# EAGLE design olive-scanner (EAGLE 7.5.0)
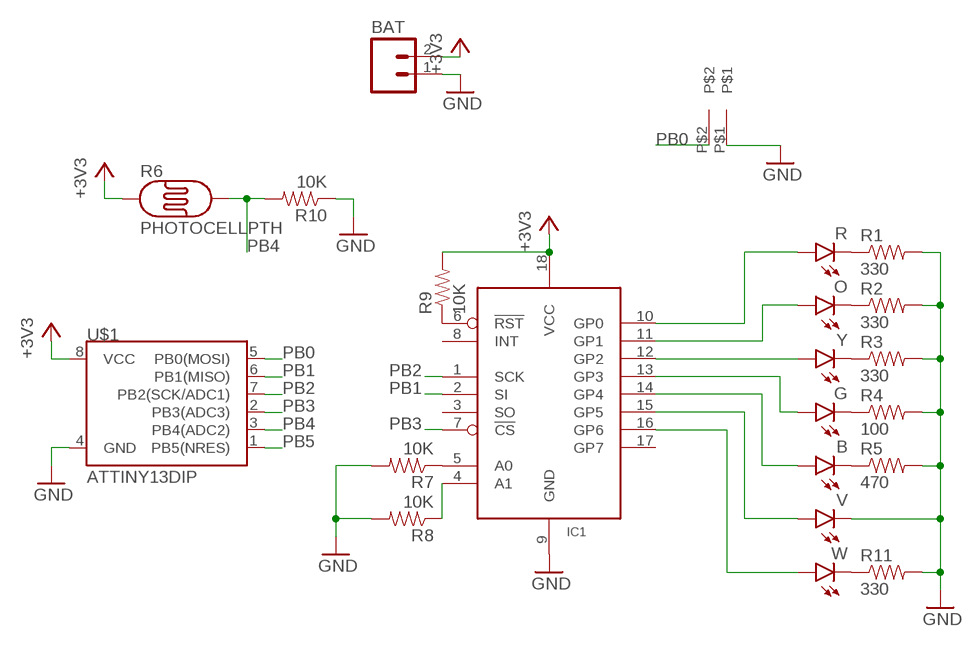
[diagram p0: schematic, sheet 1]

## Parts
B  LED5MM  [LED5MM]
BAT  M02LOCK  [1X02_LOCK]
G  LED5MM  [LED5MM]
IC1  MCP23S08/P  [DIL18]
O  LED5MM  [LED5MM]
R  LED5MM  [LED5MM]
R1  330  1KOHM-1/4W-5%(PTH)  [AXIAL-0.3]
R2  330  1KOHM-1/4W-5%(PTH)  [AXIAL-0.3]
R3  330  1KOHM-1/4W-5%(PTH)  [AXIAL-0.3]
R4  100  1KOHM-1/4W-5%(PTH)  [AXIAL-0.3]
R5  470  1KOHM-1/4W-5%(PTH)  [AXIAL-0.3]
R6  PHOTOCELLPTH  [PHOTOCELL]
R7  10K  1KOHM-1/4W-5%(PTH)  [AXIAL-0.3]
R8  10K  1KOHM-1/4W-5%(PTH)  [AXIAL-0.3]
R9  10K  1KOHM-1/4W-5%(PTH)  [AXIAL-0.3]
R10  10K  1KOHM-1/4W-5%(PTH)  [AXIAL-0.3]
R11  330  1KOHM-1/4W-5%(PTH)  [AXIAL-0.3]
U$1  ATTINY13DIP  [DIP08]
U$2  PHONE_VIBRATOR  [PHONE_VIBRATOR]
V  LED5MM  [LED5MM]
W  LED5MM  [LED5MM]
Y  LED5MM  [LED5MM]

## Nets
+3V3: BAT.2 IC1.18(VCC) R6.1 R9.P$2 U$1.8(VCC)
GND: BAT.1 IC1.9(GND) R1.P$2 R2.P$2 R3.P$2 R4.P$2 R5.P$2 R7.P$2 R8.P$2 R10.P$1 R11.P$2 U$1.4(GND) U$2.P$1 V.K(C)
N$1: IC1.4(A1) R8.P$1
N$2: IC1.6(!RST) R9.P$1
N$3: IC1.5(A0) R7.P$1
N$4: R1.P$1 R.K(C)
N$5: O.K(C) R2.P$1
N$6: R3.P$1 Y.K(C)
N$7: G.K(C) R4.P$1
N$8: B.K(C) R5.P$1
N$9: R11.P$1 W.K(C)
N$10: IC1.16(GP6) W.A
N$19: IC1.10(GP0) R.A
N$20: IC1.11(GP1) O.A
N$21: IC1.12(GP2) Y.A
N$22: G.A IC1.13(GP3)
N$23: B.A IC1.14(GP4)
N$24: IC1.15(GP5) V.A
PB0: U$1.5(PB0(MOSI)) U$2.P$2
PB1: IC1.2(SI) U$1.6(PB1(MISO))
PB2: IC1.1(SCK) U$1.7(PB2(SCK/ADC1))
PB3: IC1.7(!CS) U$1.2(PB3(ADC3))
PB4: R6.2 R10.P$2 U$1.3(PB4(ADC2))
PB5: U$1.1(PB5(NRES))
Unconnected: IC1.3(SO) IC1.8(INT) IC1.17(GP7)

## Library data of the parts
B G O R V W Y = SparkFun-LED:LED: LEDs Standard schematic elements and footprints for 5mm, 3mm, 1206, and 0603 sized LEDs. 5mm - Spark Fun Electronics SKU : COM-00529 (and others)
BAT = SparkFun-Connectors:M02: Standard 2-pin 0.1" header. Use with - straight break away headers ( PRT-00116) - right angle break away headers (PRT-00553) - swiss pins (PRT-00743) - machine pins (PRT-00117) - female headers (PRT-00115) Molex polarized connector foot print use with: PRT-08233 with associated crimp pins and housings. 2.54_SCREWTERM for use with PRT-10571. 3.5mm Screw Terminal footprints for PRT-08084 5mm Screw Terminal footprints for use with PRT-08432
IC1 = HokieGeek:MCP23S08: MCP23008 Inexpensive i2c i/o expander - 8 general purpose i/o pins with optional pullups
R1-R5 R7-R11 = SparkFun-Resistors:1KOHM-1/4W-5%(PTH): RES-08380; PROD_ID: RES-08380; VALE: 1k
R6 = SparkFun-Sensors:PHOTOCELL: CdS photoresistor. This is a low cost way to detect light levels. Resistance decreases with more incoming light. SparkFun SKU: SEN-09088
U$1 = SparkFun-DigitalIC:ATTINY13: Atmel 8-pin 1kB flash uC
U$2 = HokieGeek:PHONE_VIBRATOR

## Board
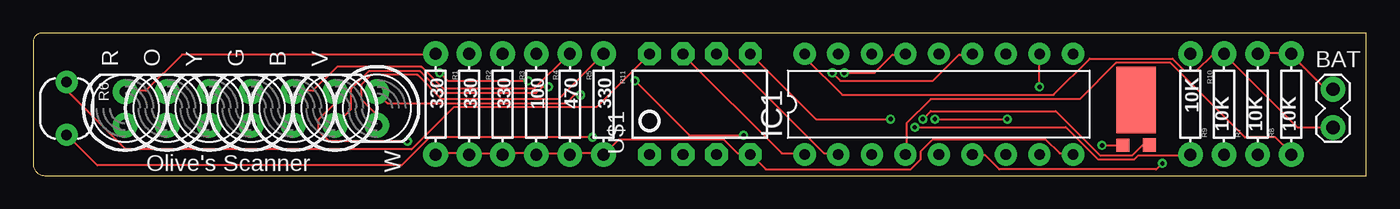
[diagram p1: board, top side]
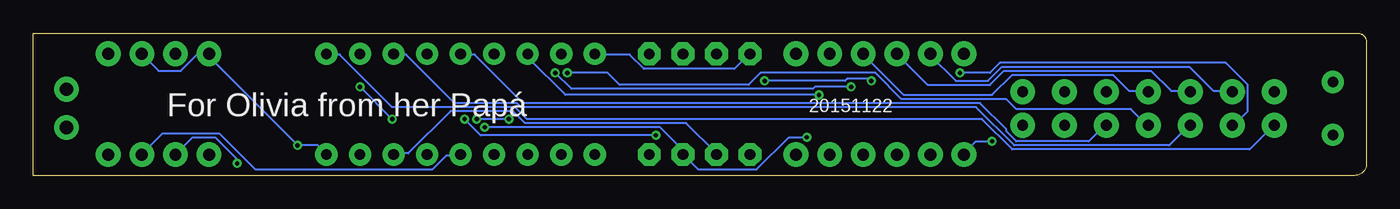
[diagram p2: board, bottom side, seen from below]

Size 100.95 x 10.79 mm. Coordinates in mm from the lower left corner, seen from the top.
Outline: 0,10.08 0,0.9 arc90 0.9,0 100.95,0 100.95,10.79 0.7,10.79 arc90 0,10.08
Copper layers (1*16): Top 0.0356mm / dielectric 1.5011mm / Bottom 0.0356mm
Design rules "LaenPCBOrder": minimum track width 6mil, minimum drill 13mil, track to track 6mil, track to pad 6mil, pad to pad 6mil, via to via 6mil, smd to smd 6mil, copper to edge 15mil, drill to drill 6mil, minimum pad ring 7mil, minimum via ring 7mil, stop-mask expansion 3mil, vias tented up to drill 0mil, thermal gap 10mil

### Footprints (pad centres in the part's own frame; a part is rotated, then mirrored left to right if it is on the bottom)
LED5MM = drill 0.813 pad 1.88: A -1.27,0; K 1.27,0
1X02_LOCK = drill 1.016 pad 1.88: 1 -0.178,0; 2 2.718,0
DIL18 = drill 0.813 pad 1.676: 1 -10.16,-3.81; 2 -7.62,-3.81; 3 -5.08,-3.81; 4 -2.54,-3.81; 5 0,-3.81; 6 2.54,-3.81; 7 5.08,-3.81; 8 7.62,-3.81; 9 10.16,-3.81; 10 10.16,3.81; 11 7.62,3.81; 12 5.08,3.81; 13 2.54,3.81; 14 0,3.81; 15 -2.54,3.81; 16 -5.08,3.81; 17 -7.62,3.81; 18 -10.16,3.81
AXIAL-0.3 = drill 0.9 pad 1.88: P$1 -3.81,0; P$2 3.81,0
PHOTOCELL = drill 0.8 pad 1.676: 1 -2,0; 2 2,0
DIP08 = drill 0.813 pad 1.727 octagon: 1 -3.81,-3.81; 2 -1.27,-3.81; 3 1.27,-3.81; 4 3.81,-3.81; 5 3.81,3.81; 6 1.27,3.81; 7 -1.27,3.81; 8 -3.81,3.81
PHONE_VIBRATOR = smd 1 x 1: P$1 -0.997,-0.889; P$2 1.005,-0.857 | smd 3 x 5: P$3 0,2.54

### Placement (x,y rotation side)
B  19.68,5.08 90 top
BAT  98.42,6.35 270 top
G  16.51,5.08 90 top
IC1  68.58,5.4 0 top
O  10.16,5.08 90 top
R  6.99,5.08 90 top
R1  30.48,5.4 270 top
R2  33.02,5.4 270 top
R3  35.56,5.4 270 top
R4  38.1,5.4 270 top
R5  40.64,5.4 270 top
R6  2.54,5.08 270 top
R7  92.71,5.4 90 top
R8  95.25,5.4 90 top
R9  90.17,5.4 90 top
R10  87.63,5.4 270 top
R11  43.18,5.4 270 top
U$1  50.48,5.4 0 top
U$2  83.5,3.17 0 top
V  22.86,5.08 90 top
W  26.04,5.08 270 top
Y  13.34,5.08 90 top

### Tracks (layer width: path | path; a pad name or v marks a point on that pad's centre or on a via)
+3V3
  Top 0.152: BAT.2 98.3,3.66 95.71,3.66 90.22,9.14 R9.P$2 90.07,9.14 89.31,9.14 88.09,7.92 87.17,7.92 86.26,8.84 80.01,8.84 77.27,6.1 61.27,6.1 58.52,8.84 58.52,9.14 IC1.18 | R6.1 2.59,7.01 2.59,6.4 7.01,1.98 28.65,1.98 31.85,5.18 42.67,5.18 46.63,9.14 U$1.8
  Bottom 0.152: IC1.18 58.37,9.14 55.78,9.14 54.71,8.08 47.85,8.08 46.79,9.14 U$1.8
GND  (via drill 0.33)
  Top 0.152: v80.92,2.29 U$2.P$1 | R7.P$2 92.81,9.3 95.25,9.3 R8.P$2 95.25,9.14 97.84,6.55 98.3,6.55 BAT.1 | 38.1,1.68 35.66,1.68 R3.P$2 35.51,1.68 33.07,1.68 R2.P$2 32.92,1.68 30.48,1.68 R1.P$2 | V.K 22.86,5.49 21.64,4.27 21.64,3.35 22.4,2.59 v28.35,2.59 | 38.1,1.68 40.54,1.68 R5.P$2 40.69,1.68 43.13,1.68 R11.P$2 43.28,1.68 44.35,2.74 52.27,2.74 53.34,1.68 54.25,1.68 U$1.4 54.41,1.52 55.47,0.46 66.45,0.46 67.21,1.22 67.21,1.83 68.12,2.74 76.66,2.74 77.72,1.68 78.64,1.68 IC1.9 | 38.1,1.68 R4.P$2
  Bottom 0.152: IC1.9 78.79,1.68 79.4,2.29 v80.92,2.29 87.78,9.14 | 87.78,9.14 88.54,9.14 89.76,7.92 91.44,7.92 92.66,9.14 R7.P$2 | 87.78,9.14 87.63,9.14 R10.P$1 87.78,9.14 | v28.35,2.59 29.57,2.59 30.48,1.68 R1.P$2
N$1
  Top 0.152: IC1.4 66.14,1.68 66.14,3.96 67.97,5.79 79.25,5.79 81.99,8.53 86.11,8.53 91.75,2.9 94.03,2.9 95.25,1.68 R8.P$1
N$2  (via drill 0.33)
  Top 0.152: v85.5,0.91 85.04,0.46 73.15,0.46 72.08,1.52 71.17,1.52 IC1.6
  Bottom 0.152: v85.5,0.91 85.5,1.22 87.17,2.9 88.85,2.9 90.07,1.68 R9.P$1
N$3
  Bottom 0.152: IC1.5 68.58,1.52 69.65,1.52 70.71,0.46 84.12,0.46 86.87,3.2 91.14,3.2 92.66,1.68 R7.P$1
N$4
  Top 0.152: R.K 7.01,6.4 8.53,6.4 11.28,9.14 30.48,9.14 R1.P$1
N$5
  Bottom 0.152: O.K 10.21,6.4 11.58,6.4 13.41,8.23 27.58,8.23 28.65,7.16 31.09,7.16 33.07,9.14 R2.P$1
N$6
  Bottom 0.152: Y.K 13.41,6.4 14.78,6.4 16.31,7.92 27.43,7.92 28.5,6.86 33.22,6.86 35.51,9.14 R3.P$1
N$7
  Bottom 0.152: G.K 16.61,6.4 17.98,6.4 19.2,7.62 26.82,7.62 28.35,6.1 35.05,6.1 38.1,9.14 R4.P$1
N$8
  Top 0.152: B.K 19.81,6.4 21.18,6.4 23.01,8.23 29.41,8.23 31.09,6.55 37.95,6.55 40.54,9.14 R5.P$1
N$9
  Top 0.152: W.K 25.91,3.81 25.91,4.72 24.84,5.79 24.84,6.86 25.6,7.62 29.11,7.62 30.94,5.79 39.78,5.79 43.13,9.14 R11.P$1
N$10  (via drill 0.33)
  Top 0.152: v41.45,6.1 41,6.1 40.39,5.49 26.82,5.49 26.06,6.25 W.A
  Bottom 0.152: v41.45,6.1 60.66,6.1 63.4,8.84 63.4,9.14 IC1.16
N$19
  Bottom 0.152: IC1.10 78.64,9.14 77.72,9.14 73.76,5.18 64.47,5.18 63.55,4.27 29.11,4.27 26.82,1.98 8.84,1.98 7.01,3.81 R.A
N$20  (via drill 0.33)
  Top 0.152: v76.2,6.71 IC1.11 | v68.28,4.27 v73.76,4.27 | v53.8,3.05 49.68,3.05 v45.57,7.16 | v37.49,7.16 31.39,7.16 v30.79,7.77
  Bottom 0.152: v73.76,4.27 v76.2,6.71 | v68.28,4.27 67.06,3.05 v53.8,3.05 | v45.57,7.16 39.47,7.16 39.32,7.32 37.64,7.32 v37.49,7.16 | v30.79,7.77 28.5,7.77 27.74,8.53 10.67,8.53 8.99,6.86 8.99,4.88 10.06,3.81 O.A
N$21
  Bottom 0.152: IC1.12 73.61,9.14 72.69,9.14 69.04,5.49 64.31,5.49 64.01,5.18 29.57,5.18 26.67,2.29 14.94,2.29 13.41,3.81 Y.A
N$22  (via drill 0.33)
  Top 0.152: v60.5,7.77 61.11,7.16 68.12,7.16 70.1,9.14 71.02,9.14 IC1.13
  Bottom 0.152: v60.5,7.77 57.45,7.77 56.54,6.86 46.79,6.86 45.87,7.77 37.19,7.77 35.2,5.79 27.28,5.79 26.52,5.03 17.83,5.03 16.61,3.81 G.A
N$23
  Bottom 0.152: IC1.14 68.58,9.14 67.51,9.14 63.86,5.49 29.26,5.49 27.28,3.5 27.28,3.35 26.52,2.59 21.03,2.59 19.81,3.81 B.A
N$24  (via drill 0.33)
  Top 0.152: v61.42,7.77 63.7,7.77 65.08,9.14 65.99,9.14 IC1.15 | v39.01,6.71 38.56,6.71 38.1,6.25 30.94,6.25 29.26,7.92 25.45,7.92 24.08,6.55 24.08,5.03 V.A
  Bottom 0.152: v61.42,7.77 60.2,6.55 41.91,6.55 41.76,6.71 v39.01,6.71
PB0  (via drill 0.33)
  Top 0.152: v67.36,4.27 67.97,4.88 77.42,4.88 80.77,1.52 83.21,1.52 83.97,2.29 84.43,2.29 U$2.P$2 | v64.92,4.27 59.28,4.27 54.41,9.14 U$1.5
  Bottom 0.152: v64.92,4.27 v67.36,4.27
PB1
  Top 0.152: IC1.2 60.96,1.68 59.89,1.68 52.43,9.14 51.82,9.14 U$1.6
PB2
  Top 0.152: IC1.1 58.37,1.68 56.69,1.68 49.23,9.14 U$1.7
PB3
  Bottom 0.152: IC1.7 73.61,1.68 72.54,1.68 69.34,4.88 64.62,4.88 63.7,3.96 51.51,3.96 49.23,1.68 U$1.2
PB4  (via drill 0.33)
  Top 0.152: v42.37,2.9 30.02,2.9 27.89,0.76 4.88,0.76 2.59,3.05 R6.2 | v66.75,3.66 78.18,3.66 80.62,1.22 83.36,1.22 83.67,1.52 87.63,1.52 R10.P$2
  Bottom 0.152: v42.37,2.9 43.74,2.9 46.18,0.46 50.6,0.46 51.66,1.52 U$1.3 51.82,1.68 51.82,1.98 53.49,3.66 v66.75,3.66

### Text on the board
tPlace: Olive's Scanner
bPlace: 20151122 | For Olivia from her Papá